# EasyEDA schematic LED.json
TITLE: Sheet_1; REV: 1.0; Date: 2022-06-12; Sheet: 1/1; Drawn By: MYAN; Company: Your Company
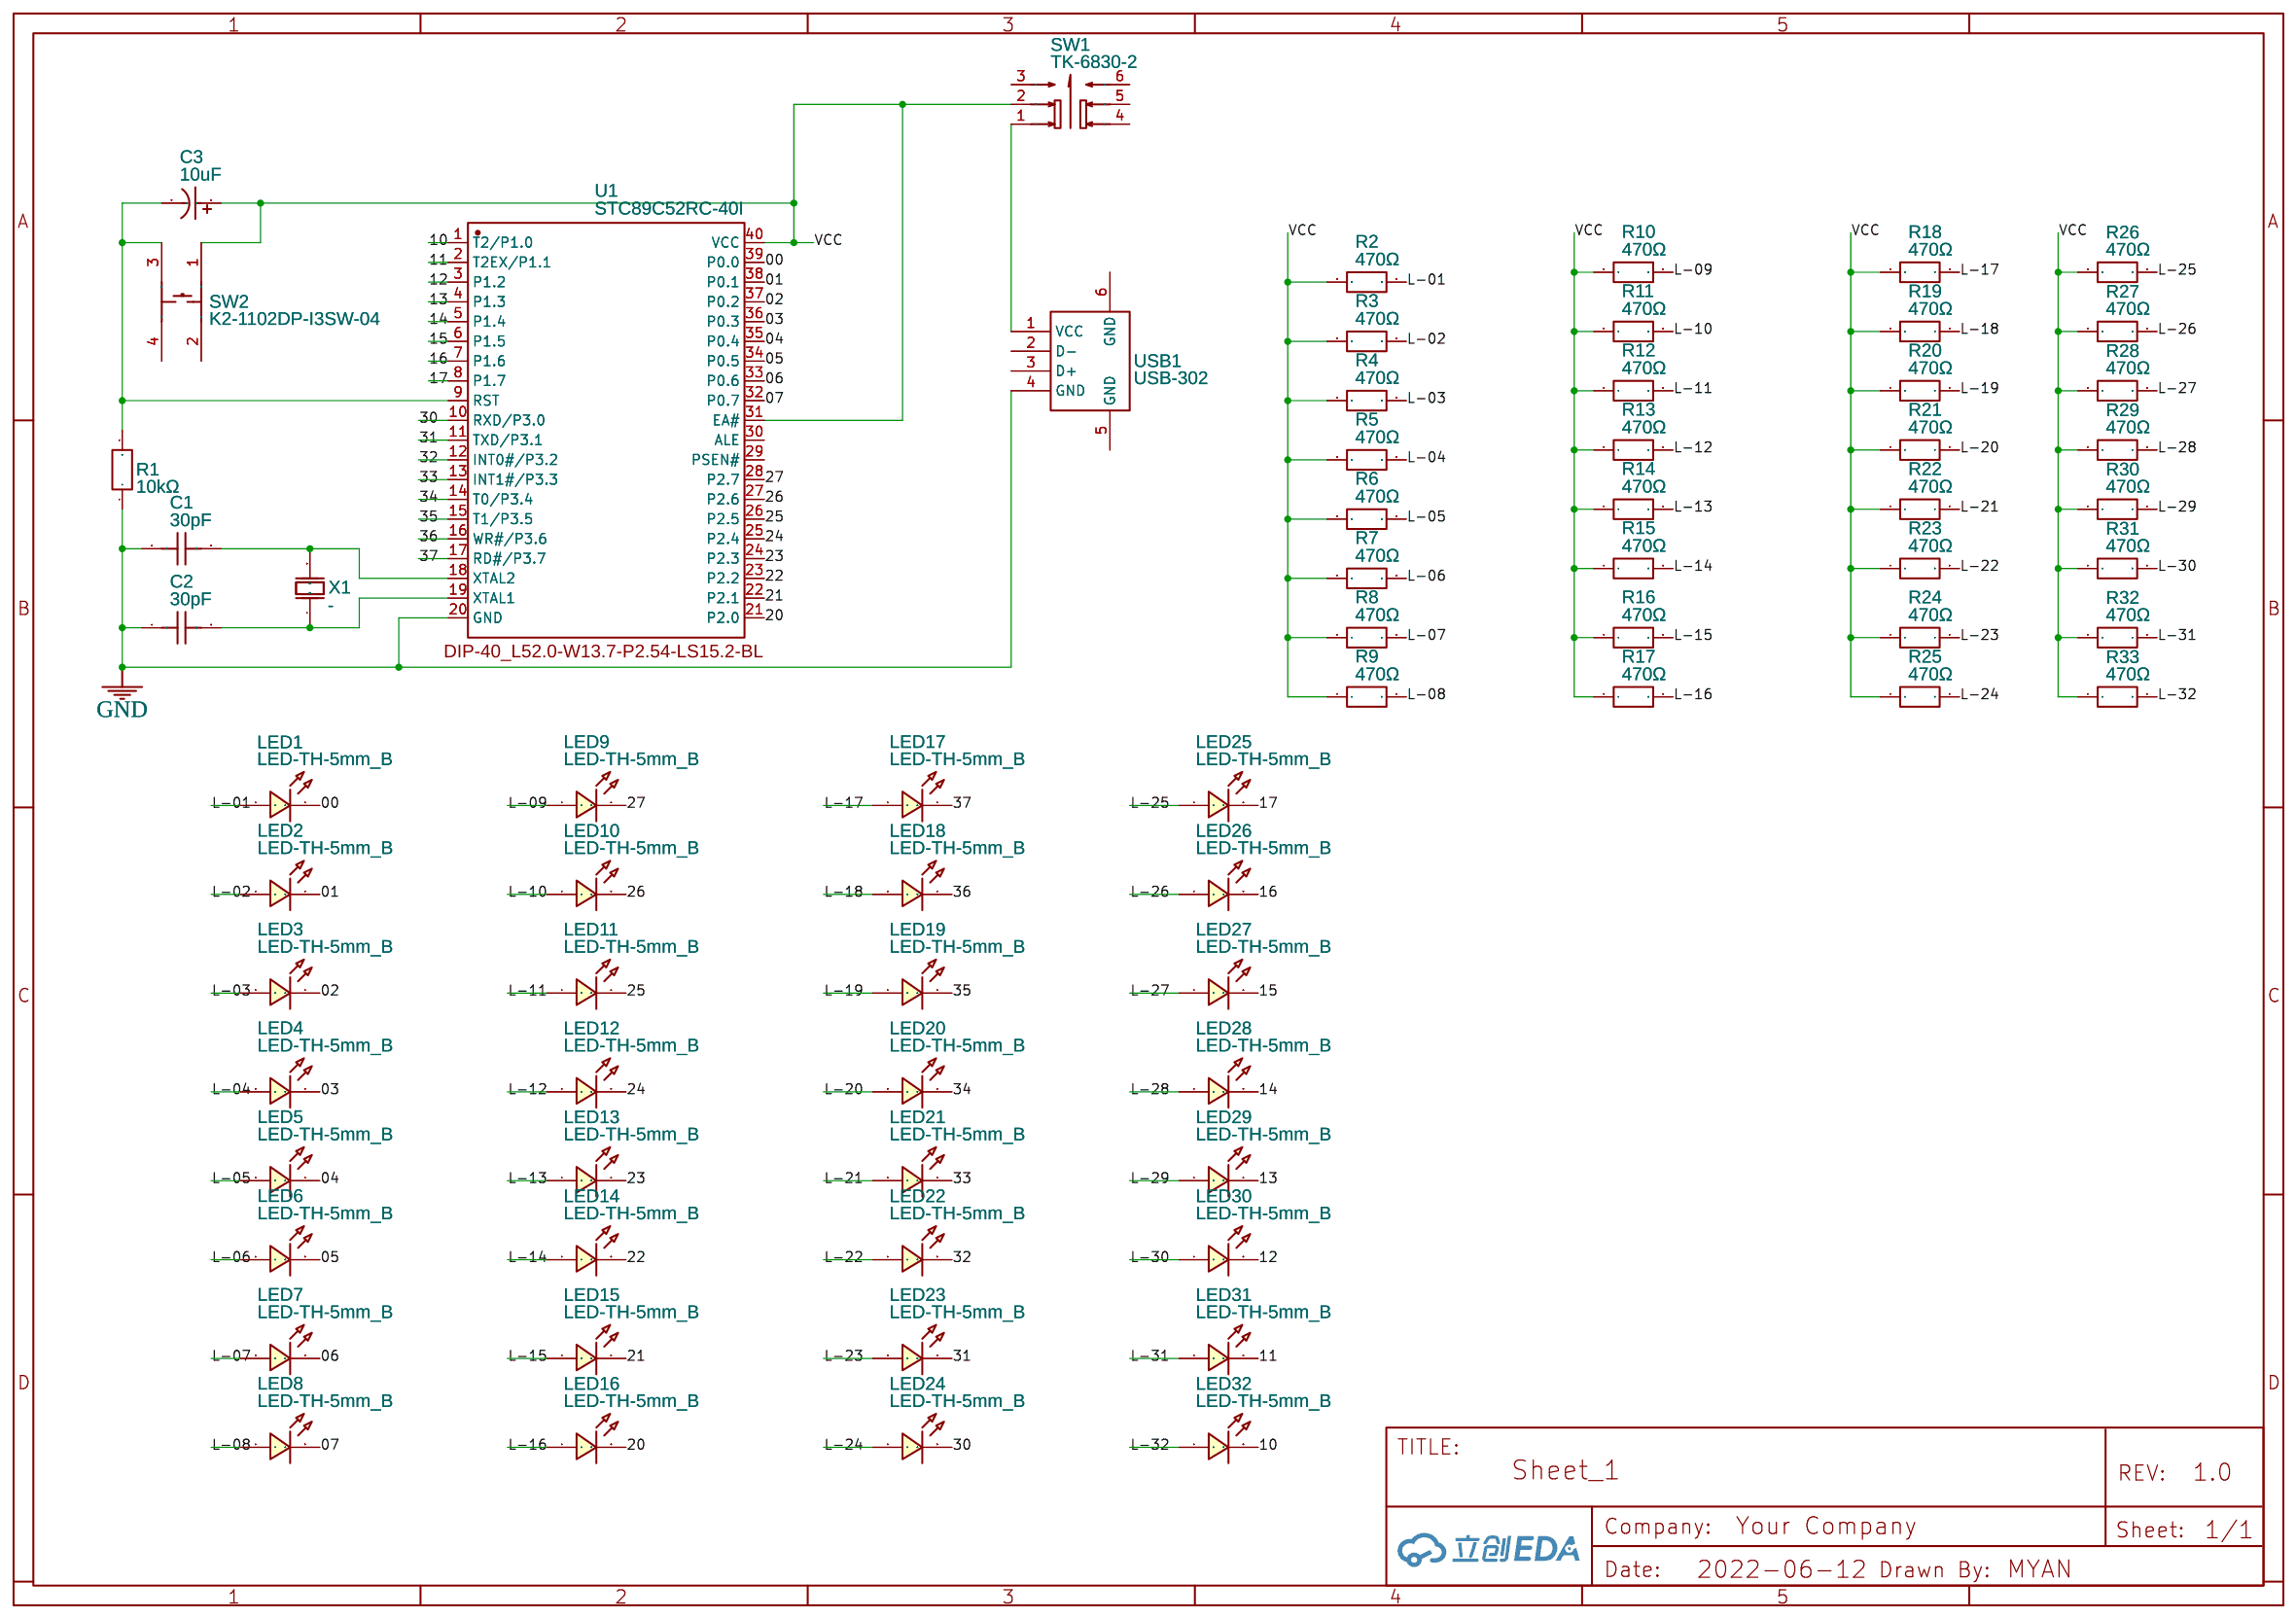
[diagram p0: schematic sheet]

## Parts
C1  30pF  [CAP-TH_L6.0-W3.5-P7.50-D1.0]
C2  30pF  [CAP-TH_L6.0-W3.5-P7.50-D1.0]
C3  10uF  [CAP-TH_BD6.3-P2.50-D1.0-FD]
LED1  LED-TH-5mm_B  [LED-TH_BD5.0_BLUE]
LED2  LED-TH-5mm_B  [LED-TH_BD5.0_BLUE]
LED3  LED-TH-5mm_B  [LED-TH_BD5.0_BLUE]
LED4  LED-TH-5mm_B  [LED-TH_BD5.0_BLUE]
LED5  LED-TH-5mm_B  [LED-TH_BD5.0_BLUE]
LED6  LED-TH-5mm_B  [LED-TH_BD5.0_BLUE]
LED7  LED-TH-5mm_B  [LED-TH_BD5.0_BLUE]
LED8  LED-TH-5mm_B  [LED-TH_BD5.0_BLUE]
LED9  LED-TH-5mm_B  [LED-TH_BD5.0_BLUE]
LED10  LED-TH-5mm_B  [LED-TH_BD5.0_BLUE]
LED11  LED-TH-5mm_B  [LED-TH_BD5.0_BLUE]
LED12  LED-TH-5mm_B  [LED-TH_BD5.0_BLUE]
LED13  LED-TH-5mm_B  [LED-TH_BD5.0_BLUE]
LED14  LED-TH-5mm_B  [LED-TH_BD5.0_BLUE]
LED15  LED-TH-5mm_B  [LED-TH_BD5.0_BLUE]
LED16  LED-TH-5mm_B  [LED-TH_BD5.0_BLUE]
LED17  LED-TH-5mm_B  [LED-TH_BD5.0_BLUE]
LED18  LED-TH-5mm_B  [LED-TH_BD5.0_BLUE]
LED19  LED-TH-5mm_B  [LED-TH_BD5.0_BLUE]
LED20  LED-TH-5mm_B  [LED-TH_BD5.0_BLUE]
LED21  LED-TH-5mm_B  [LED-TH_BD5.0_BLUE]
LED22  LED-TH-5mm_B  [LED-TH_BD5.0_BLUE]
LED23  LED-TH-5mm_B  [LED-TH_BD5.0_BLUE]
LED24  LED-TH-5mm_B  [LED-TH_BD5.0_BLUE]
LED25  LED-TH-5mm_B  [LED-TH_BD5.0_BLUE]
LED26  LED-TH-5mm_B  [LED-TH_BD5.0_BLUE]
LED27  LED-TH-5mm_B  [LED-TH_BD5.0_BLUE]
LED28  LED-TH-5mm_B  [LED-TH_BD5.0_BLUE]
LED29  LED-TH-5mm_B  [LED-TH_BD5.0_BLUE]
LED30  LED-TH-5mm_B  [LED-TH_BD5.0_BLUE]
LED31  LED-TH-5mm_B  [LED-TH_BD5.0_BLUE]
LED32  LED-TH-5mm_B  [LED-TH_BD5.0_BLUE]
R1  10kΩ  [RES-TH_BD5.0-L15.5-P19.50-D0.7]
R2  470Ω  [RES-TH_BD3.2-L9.0-P13.00-D0.5]
R3  470Ω  [RES-TH_BD3.2-L9.0-P13.00-D0.5]
R4  470Ω  [RES-TH_BD3.2-L9.0-P13.00-D0.5]
R5  470Ω  [RES-TH_BD3.2-L9.0-P13.00-D0.5]
R6  470Ω  [RES-TH_BD3.2-L9.0-P13.00-D0.5]
R7  470Ω  [RES-TH_BD3.2-L9.0-P13.00-D0.5]
R8  470Ω  [RES-TH_BD3.2-L9.0-P13.00-D0.5]
R9  470Ω  [RES-TH_BD3.2-L9.0-P13.00-D0.5]
R10  470Ω  [RES-TH_BD3.2-L9.0-P13.00-D0.5]
R11  470Ω  [RES-TH_BD3.2-L9.0-P13.00-D0.5]
R12  470Ω  [RES-TH_BD3.2-L9.0-P13.00-D0.5]
R13  470Ω  [RES-TH_BD3.2-L9.0-P13.00-D0.5]
R14  470Ω  [RES-TH_BD3.2-L9.0-P13.00-D0.5]
R15  470Ω  [RES-TH_BD3.2-L9.0-P13.00-D0.5]
R16  470Ω  [RES-TH_BD3.2-L9.0-P13.00-D0.5]
R17  470Ω  [RES-TH_BD3.2-L9.0-P13.00-D0.5]
R18  470Ω  [RES-TH_BD3.2-L9.0-P13.00-D0.5]
R19  470Ω  [RES-TH_BD3.2-L9.0-P13.00-D0.5]
R20  470Ω  [RES-TH_BD3.2-L9.0-P13.00-D0.5]
R21  470Ω  [RES-TH_BD3.2-L9.0-P13.00-D0.5]
R22  470Ω  [RES-TH_BD3.2-L9.0-P13.00-D0.5]
R23  470Ω  [RES-TH_BD3.2-L9.0-P13.00-D0.5]
R24  470Ω  [RES-TH_BD3.2-L9.0-P13.00-D0.5]
R25  470Ω  [RES-TH_BD3.2-L9.0-P13.00-D0.5]
R26  470Ω  [RES-TH_BD3.2-L9.0-P13.00-D0.5]
R27  470Ω  [RES-TH_BD3.2-L9.0-P13.00-D0.5]
R28  470Ω  [RES-TH_BD3.2-L9.0-P13.00-D0.5]
R29  470Ω  [RES-TH_BD3.2-L9.0-P13.00-D0.5]
R30  470Ω  [RES-TH_BD3.2-L9.0-P13.00-D0.5]
R31  470Ω  [RES-TH_BD3.2-L9.0-P13.00-D0.5]
R32  470Ω  [RES-TH_BD3.2-L9.0-P13.00-D0.5]
R33  470Ω  [RES-TH_BD3.2-L9.0-P13.00-D0.5]
SW1  TK-6830-2  [SW-TH_TK-6830-2]
SW2  K2-1102DP-I3SW-04  [KEY-TH_4P-L6.4-W6.0-P4.50-LS7.3-TL]
U1  STC89C52RC-40I  [DIP-40_L52.0-W13.7-P2.54-LS15.2-BL]
USB1  USB-302  [USB-A-TH_USB-302-T]
X1  -  [HC-49US_L11.5-W4.5-P4.88]

## Library data of the parts
C1 C2 = S07S1E330KN0B0S0N0: Supplier: LCSC; Supplier Part: C260735; Manufacturer: Songtian Elec; Contributor: LCSC; JLCPCB Part Class: Extended Part
C3 = 10uf/100V: Supplier: LCSC; Manufacturer: ValuePro; Supplier Part: C2029; JLCPCB Part Class: Extended Part
LED1-LED32 = LED-TH-5mm_B: Supplier: LCSC; Contributor: LCEDA_Lib
R1 = MF3WS-10KΩ±1%T: Supplier: LCSC; Supplier Part: C714189; Manufacturer: Huaxing Mechanical-Elec.; Contributor: LCSC; JLCPCB Part Class: Extended Part
R2-R33 = MF1/2W-470Ω±1%T52: Supplier: LCSC; Supplier Part: C714066; Manufacturer: Huaxing Mechanical-Elec.; Contributor: LCSC; JLCPCB Part Class: Extended Part
SW1 = TK-6830-2: Supplier: LCSC; Supplier Part: C528789; Manufacturer: Yuandi(台湾元迪); Contributor: LCSC; JLCPCB Part Class: Extended Part
SW2 = K2-1102DP-I3SW-04: Supplier: LCSC; Supplier Part: C2685962; Manufacturer: 韩国韩荣; Contributor: LCSC; JLCPCB Part Class: Extended Part
U1 = STC89C52RC-40I: Supplier: LCSC; Manufacturer: STC; Supplier Part: C14022; JLCPCB Part Class: Extended Part; Package Display: Yes
USB1 = USB-302: Supplier: LCSC; Manufacturer: SOFNG; Supplier Part: C112456; JLCPCB Part Class: Extended Part
X1 = ESA11.0592F20M25F: Supplier: LCSC; Supplier Part: C353687; Manufacturer: ZHUHAI MONEC ELEC; Contributor: LCSC; JLCPCB Part Class: Extended Part

## Nets
GND: C1.1 C2.1 R1.1 U1.20(GND) USB1.4(GND)
VCC: C3.1 R2.1 R3.1 R4.1 R5.1 R6.1 R7.1 R8.1 R9.1 R10.1 R11.1 R12.1 R13.1 R14.1 R15.1 R16.1 R17.1 R18.1 R19.1 R20.1 R21.1 R22.1 R23.1 R24.1 R25.1 R26.1 R27.1 R28.1 R29.1 R30.1 R31.1 R32.1 R33.1 SW1.2 SW2.1 U1.31(EA#) U1.40(VCC)
00: LED1.2 U1.39(P0.0)
01: LED2.2 U1.38(P0.1)
02: LED3.2 U1.37(P0.2)
03: LED4.2 U1.36(P0.3)
04: LED5.2 U1.35(P0.4)
05: LED6.2 U1.34(P0.5)
06: LED7.2 U1.33(P0.6)
07: LED8.2 U1.32(P0.7)
10: LED32.2 U1.1(T2/P1.0)
11: LED31.2 U1.2(T2EX/P1.1)
12: LED30.2 U1.3(P1.2)
13: LED29.2 U1.4(P1.3)
14: LED28.2 U1.5(P1.4)
15: LED27.2 U1.6(P1.5)
16: LED26.2 U1.7(P1.6)
17: LED25.2 U1.8(P1.7)
20: LED16.2 U1.21(P2.0)
21: LED15.2 U1.22(P2.1)
22: LED14.2 U1.23(P2.2)
23: LED13.2 U1.24(P2.3)
24: LED12.2 U1.25(P2.4)
25: LED11.2 U1.26(P2.5)
26: LED10.2 U1.27(P2.6)
27: LED9.2 U1.28(P2.7)
30: LED24.2 U1.10(RXD/P3.0)
31: LED23.2 U1.11(TXD/P3.1)
32: LED22.2 U1.12(INT0#/P3.2)
33: LED21.2 U1.13(INT1#/P3.3)
34: LED20.2 U1.14(T0/P3.4)
35: LED19.2 U1.15(T1/P3.5)
36: LED18.2 U1.16(WR#/P3.6)
37: LED17.2 U1.17(RD#/P3.7)
L-01: LED1.1 R2.2
L-02: LED2.1 R3.2
L-03: LED3.1 R4.2
L-04: LED4.1 R5.2
L-05: LED5.1 R6.2
L-06: LED6.1 R7.2
L-07: LED7.1 R8.2
L-08: LED8.1 R9.2
L-09: LED9.1 R10.2
L-10: LED10.1 R11.2
L-11: LED11.1 R12.2
L-12: LED12.1 R13.2
L-13: LED13.1 R14.2
L-14: LED14.1 R15.2
L-15: LED15.1 R16.2
L-16: LED16.1 R17.2
L-17: LED17.1 R18.2
L-18: LED18.1 R19.2
L-19: LED19.1 R20.2
L-20: LED20.1 R21.2
L-21: LED21.1 R22.2
L-22: LED22.1 R23.2
L-23: LED23.1 R24.2
L-24: LED24.1 R25.2
L-25: LED25.1 R26.2
L-26: LED26.1 R27.2
L-27: LED27.1 R28.2
L-28: LED28.1 R29.2
L-29: LED29.1 R30.2
L-30: LED30.1 R31.2
L-31: LED31.1 R32.2
L-32: LED32.1 R33.2
Net-(C1-2): C1.2 U1.18(XTAL2) X1.2(OSC2)
Net-(C2-2): C2.2 U1.19(XTAL1) X1.1(OSC1)
Net-(C3-2): C3.2 R1.2 SW2.3 U1.9(RST)
Net-(SW1-1): SW1.1 USB1.1(VCC)

Not connected (* = marked no-connect by the designer): SW1 3 4 5 6; SW2 2 4; U1 29(PSEN#) 30(ALE); USB1 2(D-) 3(D+) 5(GND) 6(GND)
